# EAGLE schematic tmtr_board_rev1 (EAGLE 6.3)

## Sheet 1 of 3
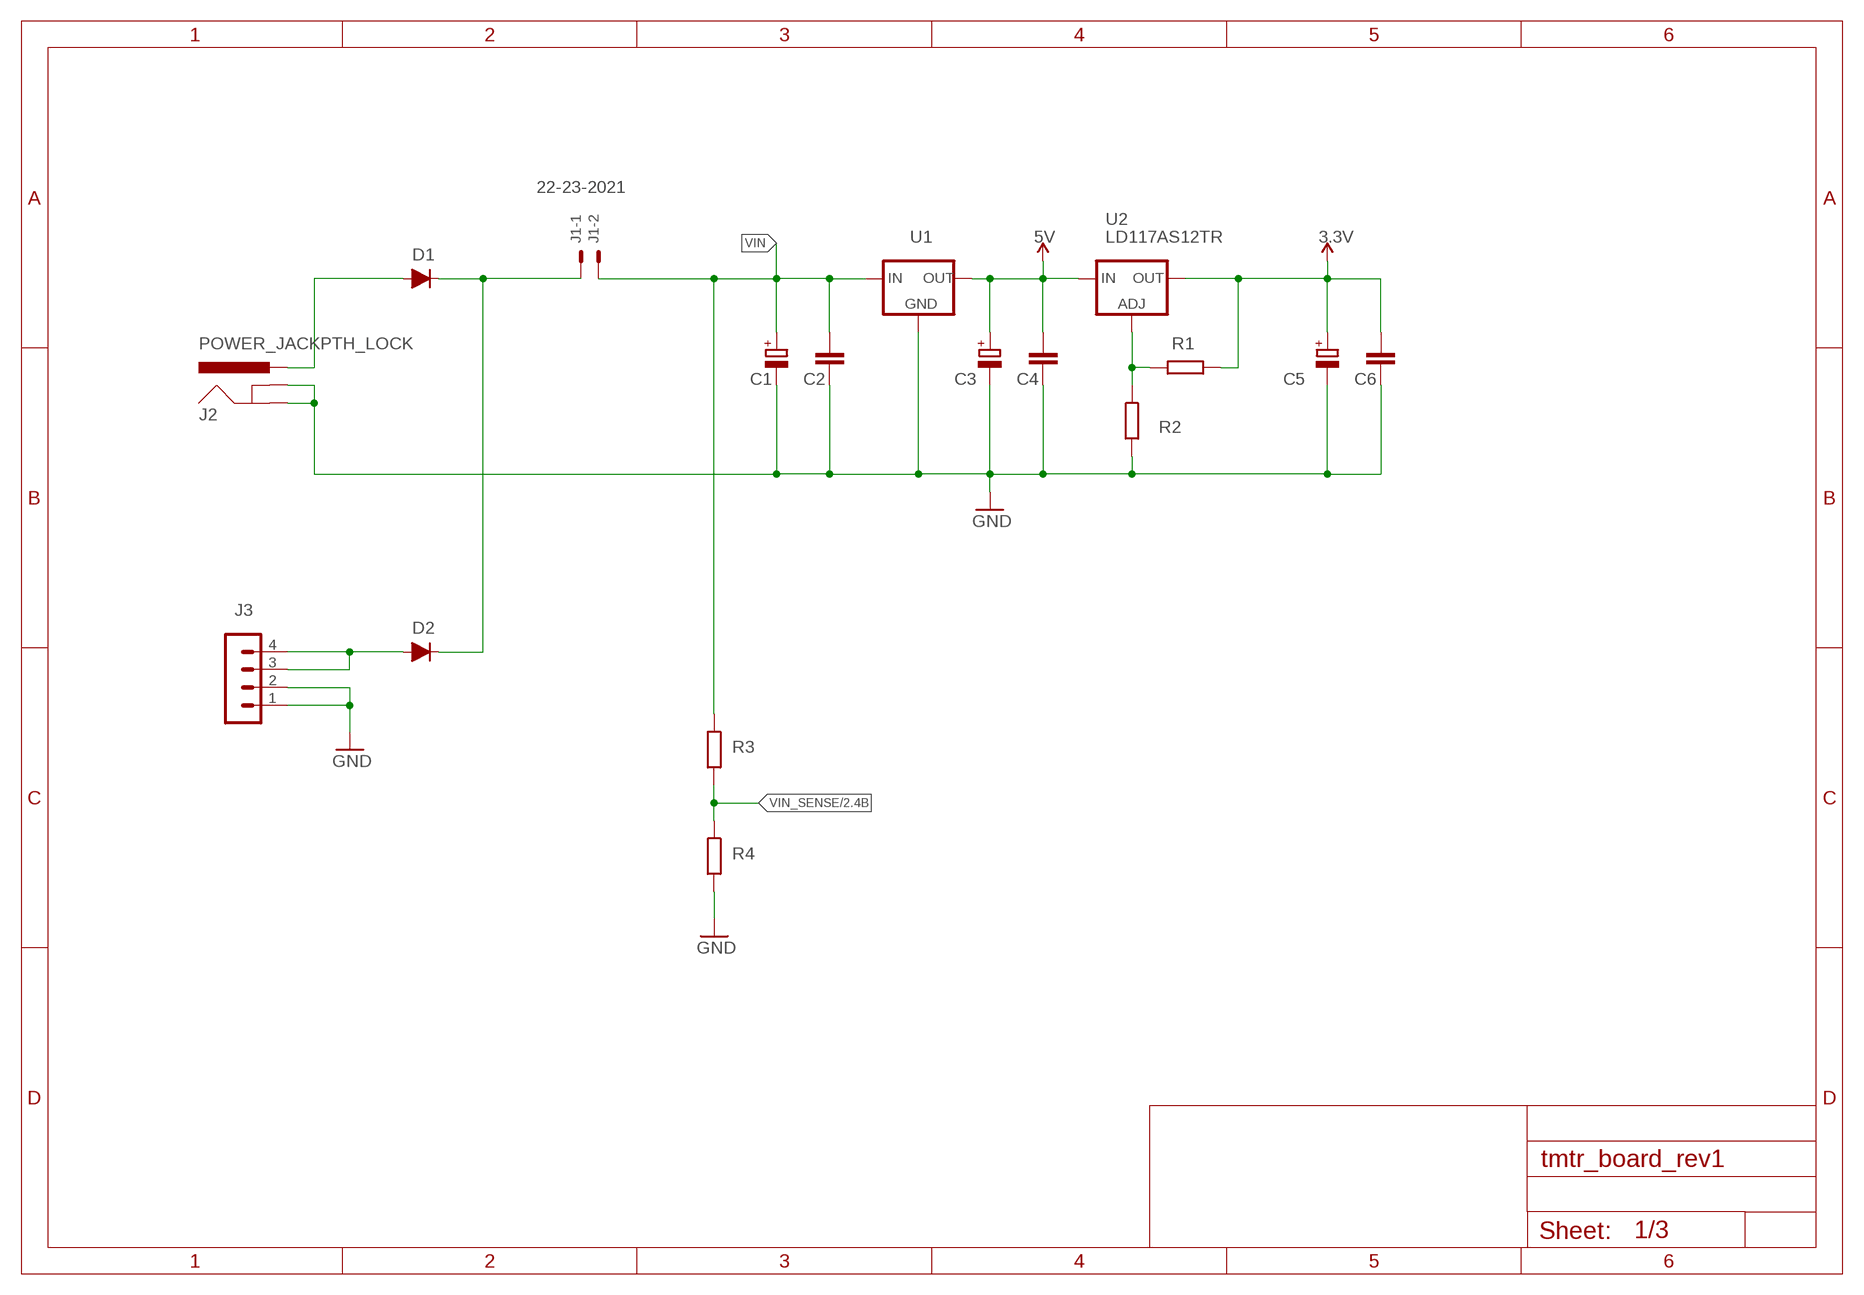
[diagram p0: schematic, sheet 1]

### Parts
C1  CPOL-EUE5-6  [E5-6]
C2  CAPPTH  [CAP-PTH-SMALL]
C3  CPOL-EUE2.5-6  [E2,5-6]
C4  CAPPTH  [CAP-PTH-SMALL]
C5  CPOL-EUE2.5-6  [E2,5-6]
C6  CAPPTH  [CAP-PTH-SMALL]
D1  D-FILL-SMB  [SMB]
D2  D-FILL-SMB  [SMB]
J1  22-23-2021  [22-23-2021]
J2  POWER_JACKPTH_LOCK  [POWER_JACK_PTH_LOCK]
J3  MA04-1  [MA04-1]
R1  R-EU_M0805  [M0805]
R2  R-EU_M0805  [M0805]
R3  R-EU_M0805  [M0805]
R4  R-EU_M0805  [M0805]
U1  78XXS  [78XXS]
U2  LD117AS12TR  [SOT223]

### Nets
3.3V: C5.+ C6.2 R1.2 U2.4(OUT) ; also sheet 3
5V: C3.+ C4.2 U1.OUT U2.3(IN) ; also sheet 2
GND: C1.- C2.1 C3.- C4.1 C5.- C6.1 J2.GND J2.GNDBREAK J3.1 J3.2 R2.2 R4.2 U1.GND ; also sheet 2,3
N$1: D1.2(A) J2.PWR
N$2: D2.2(A) J3.3 J3.4
N$4: D1.1(C) D2.1(C) J1.1
N$20: R1.1 R2.1 U2.1(ADJ)
VIN: C1.+ C2.2 J1.2 R3.1 U1.IN
VIN_SENSE: R3.2 R4.1 ; also sheet 2

## Sheet 2 of 3
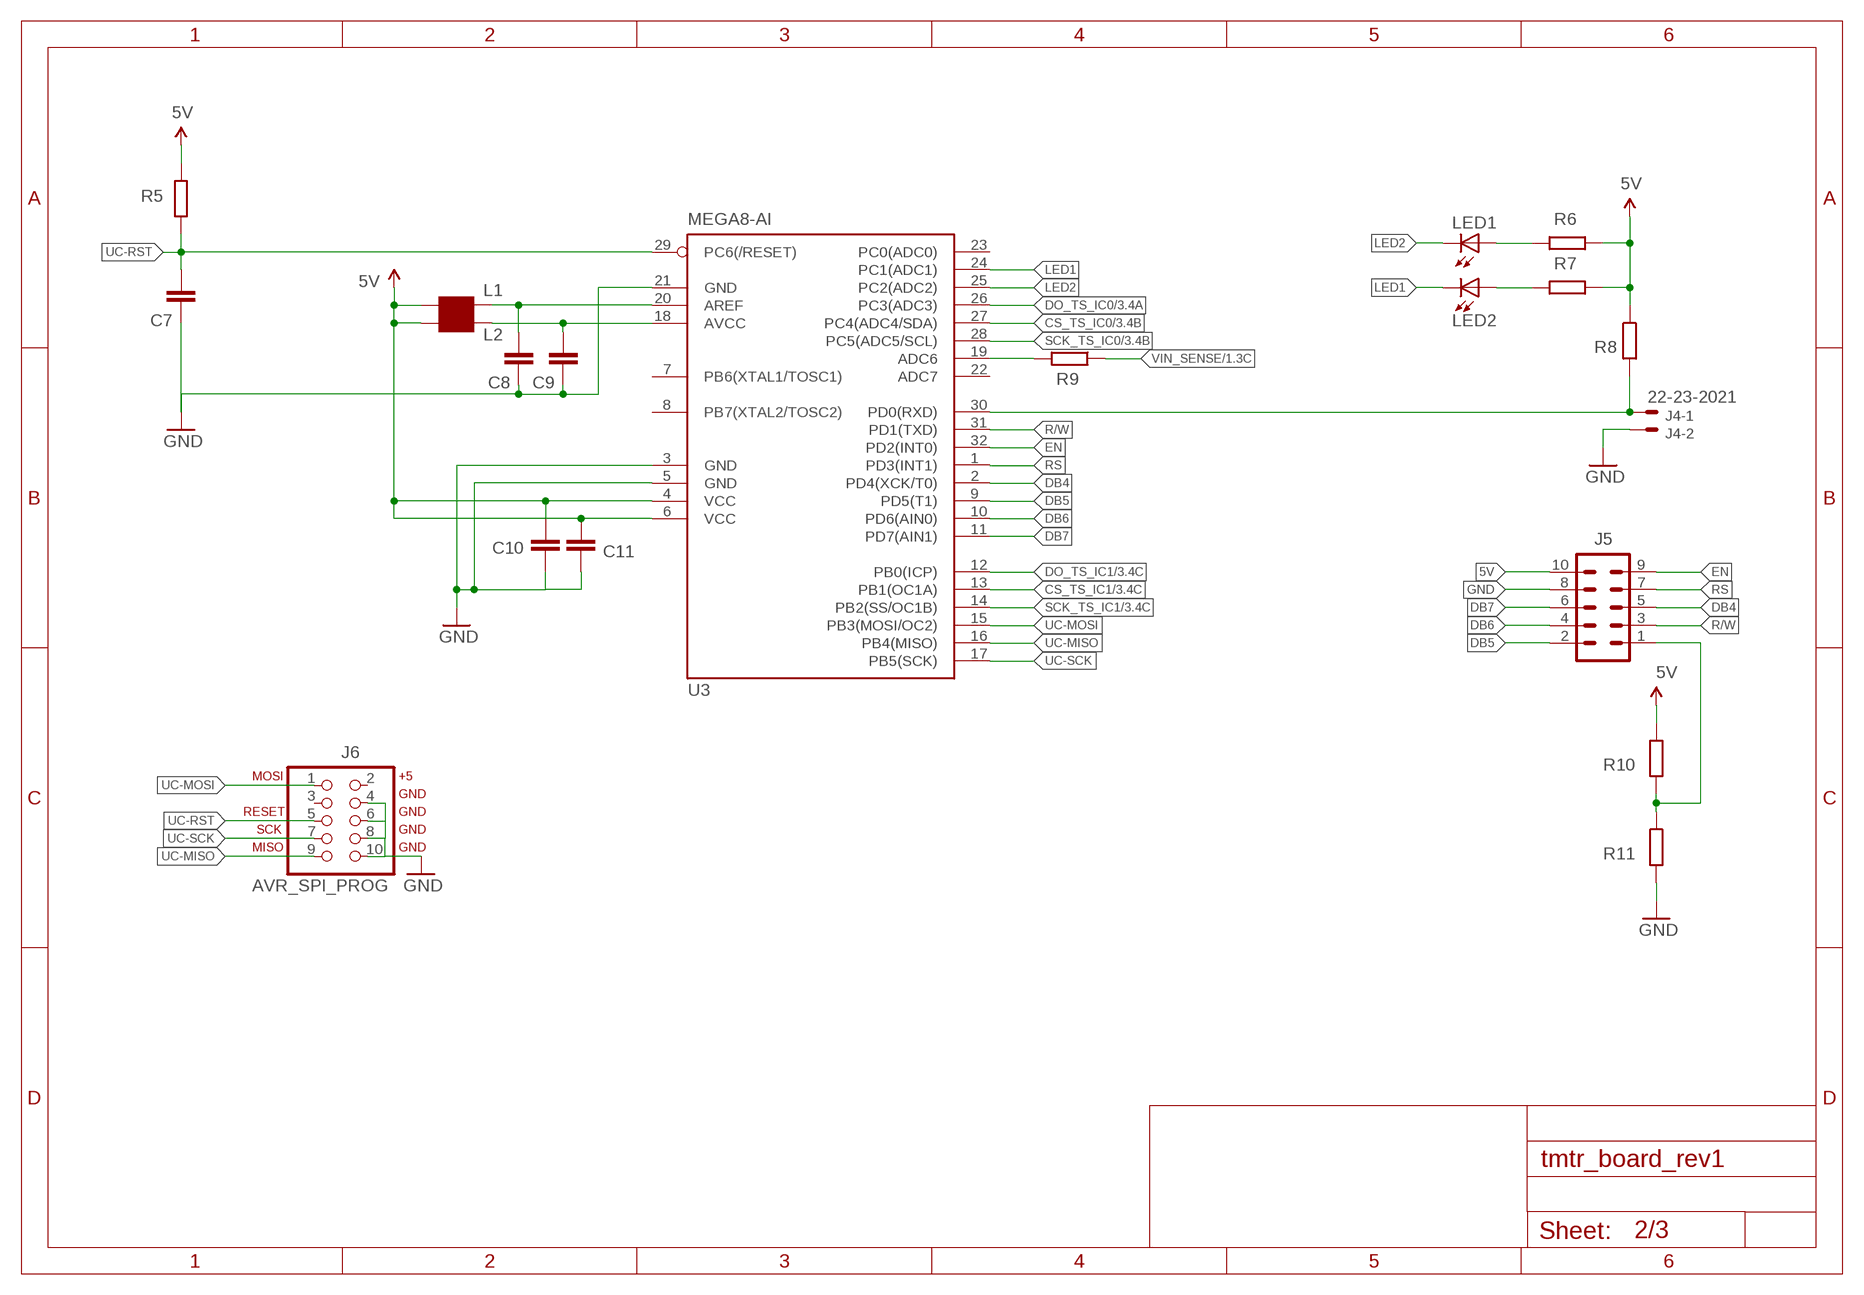
[diagram p1: schematic, sheet 2]

### Parts
C7  CAP0805  [0805]
C8  CAP0805  [0805]
C9  CAP0805  [0805]
C10  CAP0805  [0805]
C11  CAP0805  [0805]
J4  22-23-2021  [22-23-2021]
J5  MA05-2  [MA05-2]
J6  AVR_SPI_PROG  [AVR_ICSP]
L1  WE-CBF_0805  [0805]
L2  WE-CBF_0805  [0805]
LED1  LEDCHIPLED_0805  [CHIPLED_0805]
LED2  LEDCHIPLED_0805  [CHIPLED_0805]
R5  R-EU_R0805W  [R0805W]
R6  R-EU_M0805  [M0805]
R7  R-EU_M0805  [M0805]
R8  R-EU_M0805  [M0805]
R9  R-EU_M0805  [M0805]
R10  R-EU_M0805  [M0805]
R11  R-EU_M0805  [M0805]
U3  MEGA8-AI  [TQFP32-08]

### Nets
5V: C10.2 C11.2 J5.10 L1.1 L2.1 R5.2 R6.1 R7.1 R8.1 R10.1 U3.4(VCC) U3.6(VCC) ; also sheet 1
CS_TS_IC0: U3.27(PC4(ADC4/SDA)) ; also sheet 3
CS_TS_IC1: U3.13(PB1(OC1A)) ; also sheet 3
DB4: J5.5 U3.2(PD4(XCK/T0))
DB5: J5.2 U3.9(PD5(T1))
DB6: J5.4 U3.10(PD6(AIN0))
DB7: J5.6 U3.11(PD7(AIN1))
DO_TS_IC0: U3.26(PC3(ADC3)) ; also sheet 3
DO_TS_IC1: U3.12(PB0(ICP)) ; also sheet 3
EN: J5.9 U3.32(PD2(INT0))
GND: C7.1 C10.1 C11.1 J4.2 J5.8 J6.4 J6.6 J6.8 J6.10 R11.2 U3.3(GND) U3.5(GND) ; also sheet 1,3
LED1: LED2.C U3.24(PC1(ADC1))
LED2: LED1.C U3.25(PC2(ADC2))
N$3: R9.2 U3.19(ADC6)
N$5: C8.2 L1.2 U3.20(AREF)
N$6: C9.2 L2.2 U3.18(AVCC)
N$7: C8.1 C9.1 U3.21(GND)
N$9: J4.1 R8.2 U3.30(PD0(RXD))
N$10: LED2.A R7.2
N$12: LED1.A R6.2
N$13: J5.1 R10.2 R11.1
R/W: J5.3 U3.31(PD1(TXD))
RS: J5.7 U3.1(PD3(INT1))
SCK_TS_IC0: U3.28(PC5(ADC5/SCL)) ; also sheet 3
SCK_TS_IC1: U3.14(PB2(SS/OC1B)) ; also sheet 3
UC-MISO: J6.9 U3.16(PB4(MISO))
UC-MOSI: J6.1 U3.15(PB3(MOSI/OC2))
UC-RST: C7.2 J6.5 R5.1 U3.29(PC6(/RESET))
UC-SCK: J6.7 U3.17(PB5(SCK))
VIN_SENSE: R9.1 ; also sheet 1
Unconnected: J6.2 J6.3 U3.7(PB6(XTAL1/TOSC1)) U3.8(PB7(XTAL2/TOSC2)) U3.22(ADC7) U3.23(PC0(ADC0))

## Sheet 3 of 3
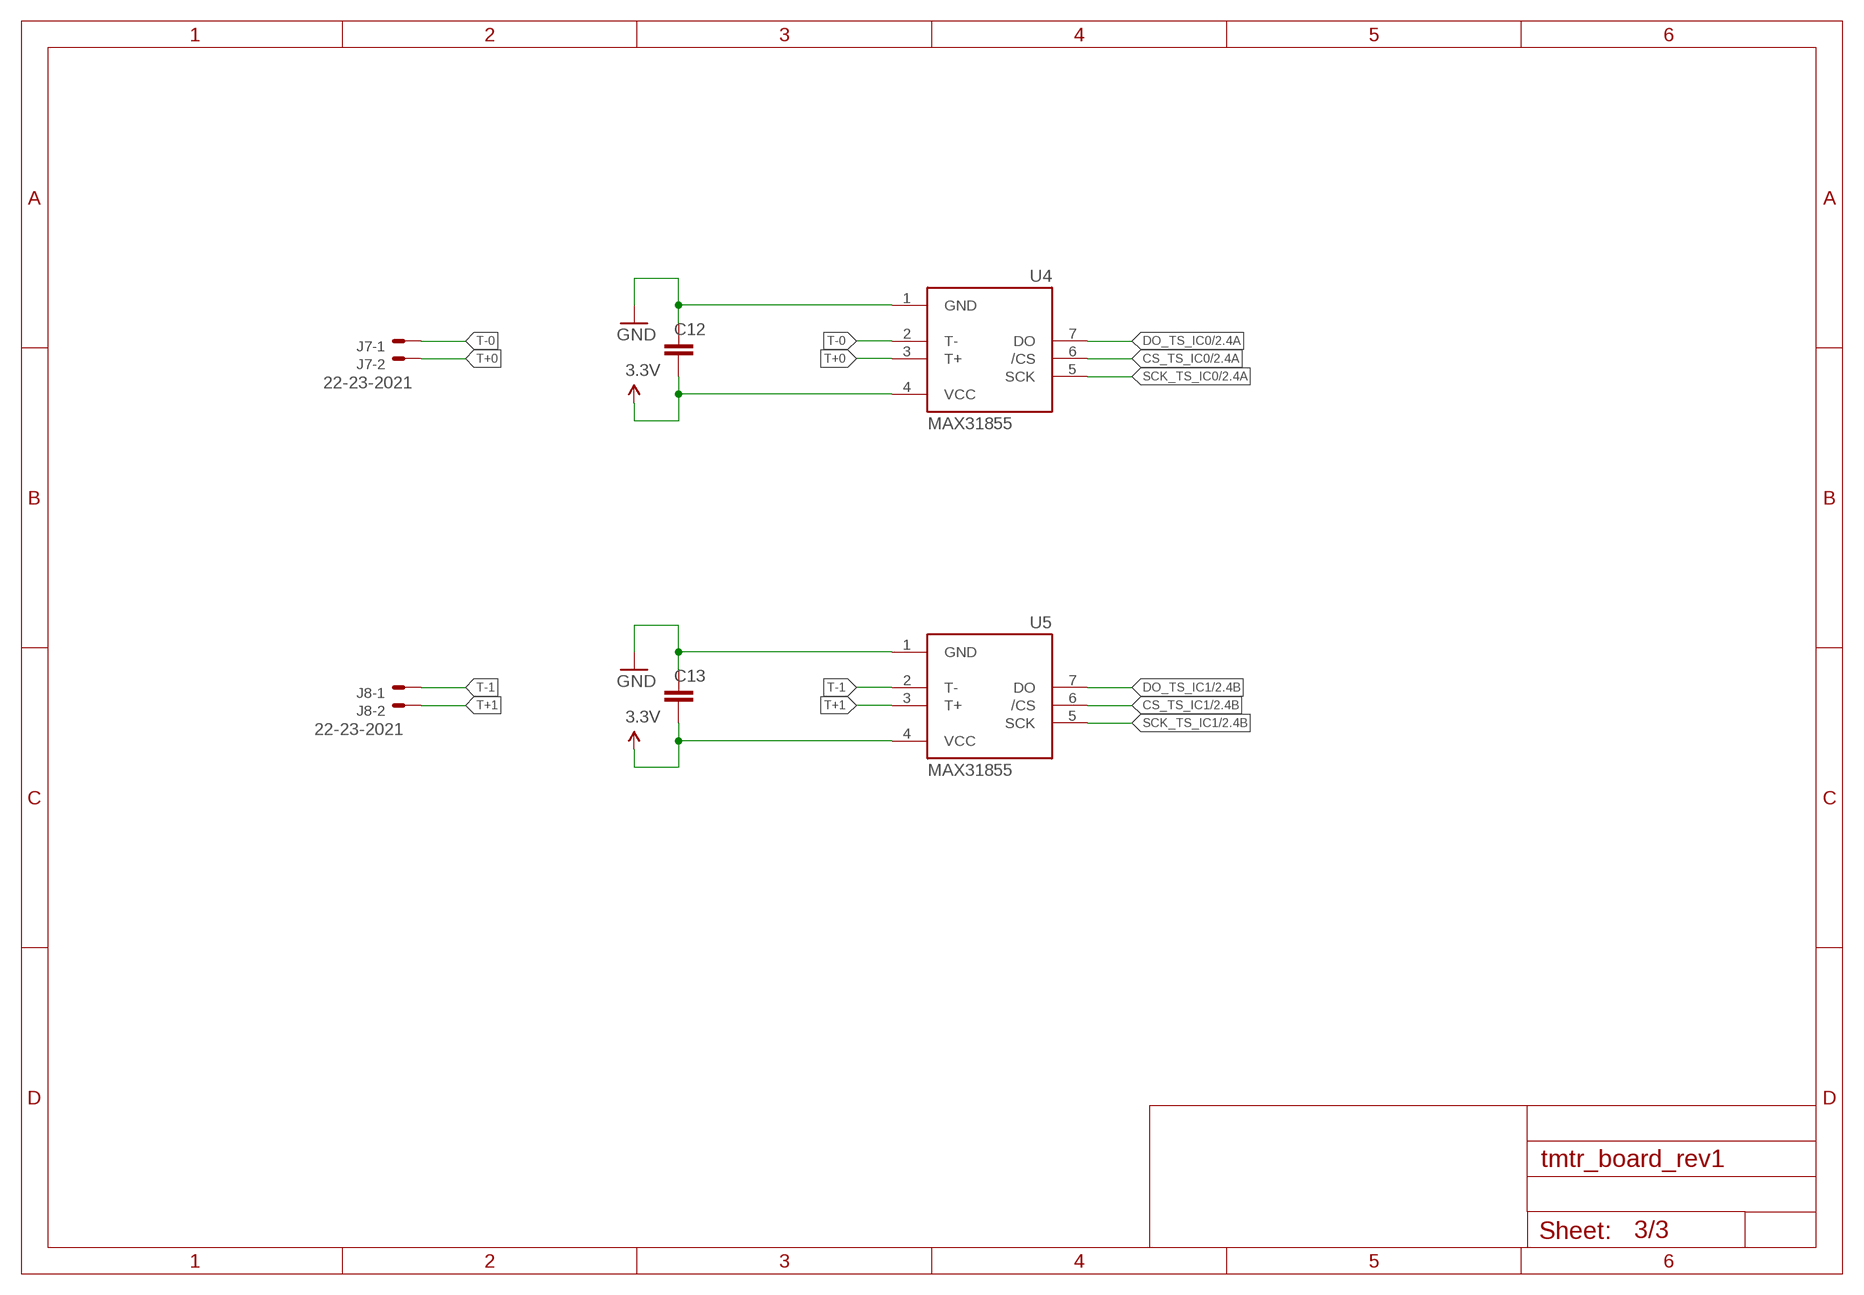
[diagram p2: schematic, sheet 3]

### Parts
C12  CAP0805  [0805]
C13  CAP0805  [0805]
J7  22-23-2021  [22-23-2021]
J8  22-23-2021  [22-23-2021]
U4  MAX31855  MAX6675  [SO08]
U5  MAX31855  MAX6675  [SO08]

### Nets
3.3V: C12.1 C13.1 U4.4(VCC) U5.4(VCC) ; also sheet 1
CS_TS_IC0: U4.6(/CS) ; also sheet 2
CS_TS_IC1: U5.6(/CS) ; also sheet 2
DO_TS_IC0: U4.7(DO) ; also sheet 2
DO_TS_IC1: U5.7(DO) ; also sheet 2
GND: C12.2 C13.2 U4.1(GND) U5.1(GND) ; also sheet 1,2
SCK_TS_IC0: U4.5(SCK) ; also sheet 2
SCK_TS_IC1: U5.5(SCK) ; also sheet 2
T+0: J7.2 U4.3(T+)
T+1: J8.2 U5.3(T+)
T-0: J7.1 U4.2(T-)
T-1: J8.1 U5.2(T-)

## Library data of the parts
C1 C3 C5 = rcl:CPOL-EU: POLARIZED CAPACITOR, European symbol
C2 C4 C6-C13 = SparkFun1:CAP: Capacitor Standard 0603 ceramic capacitor, and 0.1" leaded capacitor.
D1 D2 = semicon-smd-ipc:D-FILL-: DIODE filled
J1 J4 J7 J8 = con-molex:22-23-2021: .100" (2.54mm) Center Header - 2 Pin; MF: MOLEX; MPN: 22-23-2021; OC_FARNELL: 1462926; OC_NEWARK: 25C3832
J2 = SparkFun4:POWER_JACK: Power Jack This is the standard 5.5mm barrel jack for power. The PTH is the most common, proven, reliable, footprint. All others are experimental. The Slot footprint only works if the mill layer is transmitted to the PCB fab house so be warned. Spark Fun Electronics SKU : PRT-00119. Mating wall wart : TOL-00298 (and others)
J3 = con-lstb:MA04-1: PIN HEADER; OC_FARNELL: unknown; OC_NEWARK: unknown
J5 = con-lstb:MA05-2: PIN HEADER; OC_FARNELL: unknown; OC_NEWARK: unknown
J6 = SparkFun2:AVR_SPI_PROG: AVR ICSP Header This is the standard AVR In Circuit Serial Programming header. Minimal, but includes pin one indicator. Works with standard Olimex programmers. Also look for the 6-pin reduced version.
L1 L2 = wuerth-elektronik:WE-CBF: SMD EMI Suppression Ferrite Beads - excellent anti-EMI properties - low DCR - impedances till 3000 ohms - rated current up to 6 A
LED1 LED2 = led:LED: LED OSRAM: - CHIPLED LG R971, LG N971, LY N971, LG Q971, LY Q971, LO R971, LY R971 LH N974, LH R974 LS Q976, LO Q976, LY Q976 LO Q996 - Hyper CHIPLED LW Q18S LB Q993, LB Q99A, LB R99A - SideLED LS A670, LO A670, LY A670, LG A670, LP A670 LB A673, LV A673, LT A673, LW A673 LH A674 LY A675 LS A676, LA A676, LO A676, LY A676, LW A676 LS A679, LY A679, LG A679 - Hyper Micro SIDELED® LS Y876, LA Y876, LO Y876, LY Y876 LT Y87S - SmartLED LW L88C, LW L88S LB L89C, LB L89S, LG L890 LS L89K, LO L89K, LY L89K LS L896, LA L896, LO L896, LY L896 - TOPLED LS T670, LO T670, LY T670, LG T670, LP T670 LSG T670, LSP T670, LSY T670, LOP T670, LYG T670 LG T671, LOG T671, LSG T671 LB T673, LV T673, LT T673, LW T673 LH T674 LS T676, LA T676, LO T676, LY T676, LB T676, LH T676, LSB T676, LW T676 LB T67C, LV T67C, LT T67C, LS T67K, LO T67K, LY T67K, LW E67C LS E67B, LA E67B, LO E67B, LY E67B, LB E67C, LV E67C, LT E67C LW T67C LS T679, LY T679, LG T679 LS T770, LO T770, LY T770, LG T770, LP T770 LB T773, LV T773, LT T773, LW T773 LH T774 LS E675, LA E675, LY E675, LS T675 LS T776, LA T776, LO T776, LY T776, LB T776 LHGB T686 LT T68C, LB T68C - Hyper Mini TOPLED® LB M676 - Mini TOPLED Santana® LG M470 LS M47K, LO M47K, LY M47K Source: http://www.osram.convergy.de LUXEON: - LUMILED® LXK2-PW12-R00, LXK2-PW12-S00, LXK2-PW14-U00, LXK2-PW14-V00 LXK2-PM12-R00, LXK2-PM12-S00, LXK2-PM14-U00 LXK2-PE12-Q00, LXK2-PE12-R00, LXK2-PE12-S00, LXK2-PE14-T00, LXK2-PE14-U00 LXK2-PB12-K00, LXK2-PB12-L00, LXK2-PB12-M00, LXK2-PB14-N00, LXK2-PB14-P00, LXK2-PB14-Q00 LXK2-PR12-L00, LXK2-PR12-M00, LXK2-PR14-Q00, LXK2-PR14-R00 LXK2-PD12-Q00, LXK2-PD12-R00, LXK2-PD12-S00 LXK2-PH12-R00, LXK2-PH12-S00 LXK2-PL12-P00, LXK2-PL12-Q00, LXK2-PL12-R00 Source: www.luxeon.com KINGBRIGHT: KA-3528ASYC Source: www.kingbright.com
R1-R11 = resistor:R-EU_: RESISTOR, European symbol
U1 = v-reg:78XXS: VOLTAGE REGULATOR
U2 = v-reg:LD117A?*: Low drop fixed and adjustable positive voltage regulators 1 A Source: http://www.st.com/stonline/products/literature/ds/7194/ld1117axx.pdf
U3 = atmel:MEGA8: MICROCONTROLLER 8 Kbytes FLASH, 1 kbytes SRAM, 512 bytes EEPROM, USART, 6-channel 10 bit ADC, 2-channel 8 bit ADC Pin compatible with Atmega48, ATMega88, ATMega168 Source: avr.lbr
U4 U5 = adafruit:MAX6675